# EAGLE design Brians test board 10 (EAGLE 6.5.0)
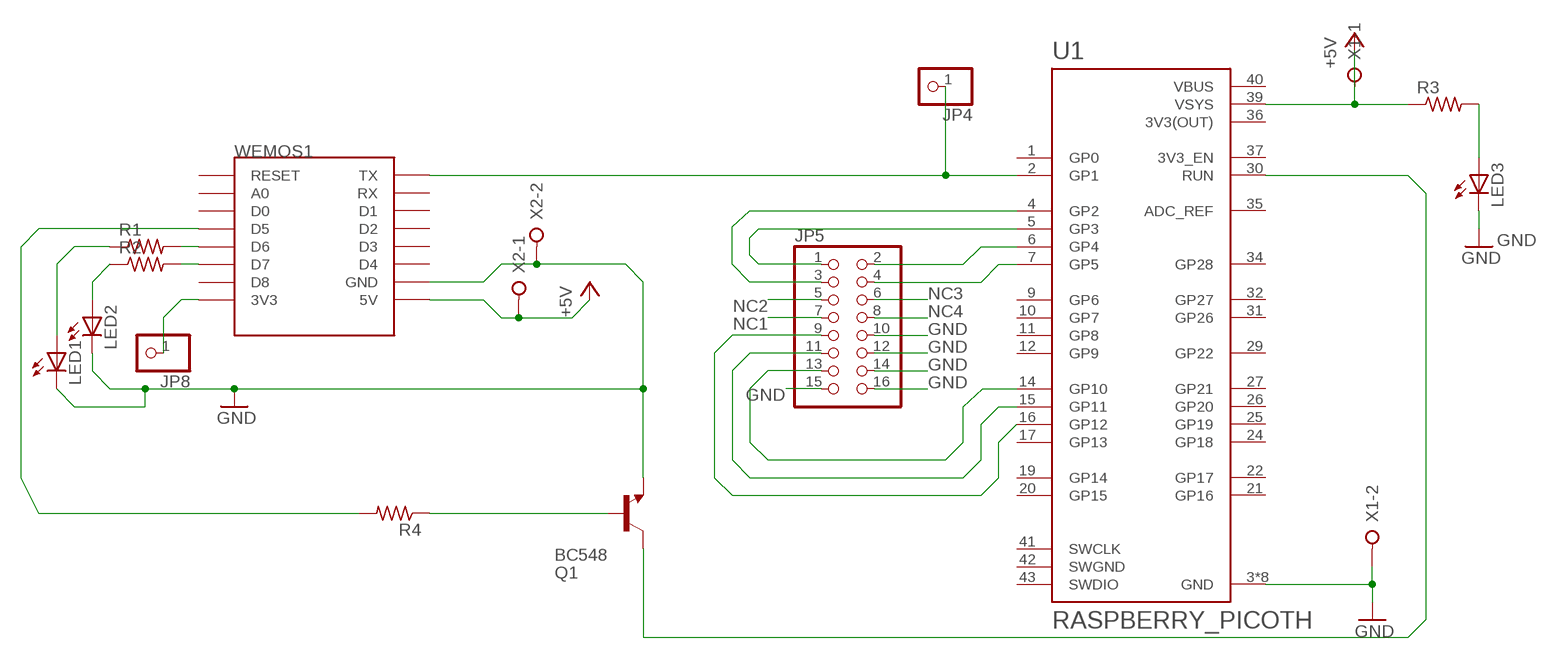
[diagram p0: schematic, sheet 1]

## Parts
JP4  PINHD-1X1  [1X01]
JP5  PINHD-2X8  [2X08]
JP8  PINHD-1X1  [1X01]
LED1  LED3MM  [LED3MM]
LED2  LED3MM  [LED3MM]
LED3  LED3MM  [LED3MM]
Q1  BC548  [TO92-EBC]
R1  R-US_0204/2V  [0204V]
R2  R-US_0204/2V  [0204V]
R3  R-US_0204/5  [0204/5]
R4  R-US_0204/2V  [0204V]
U1  RASPBERRY_PICOTH  [PICO-PKG-TH]
WEMOS1  WEMOS-D1-MINI  [WEMOS-D1-MINI]
X1  W237-02P  [W237-132]
X2  W237-02P  [W237-132]

## Nets
+5V: R3.1 U1.39(VSYS) WEMOS1.5V X1.1 X2.1
GND: JP5.10 JP5.12 JP5.14 JP5.15 JP5.16 LED1.K(C) LED2.K(C) LED3.K(C) Q1.E U1.3(GND) U1.8(GND) U1.13(GND) U1.18(GND) U1.23(GND) U1.28(GND) U1.33(GND) U1.38(GND) WEMOS1.GND X1.2 X2.2
N$3: JP5.1 U1.5(GP3)
N$4: JP8.1 WEMOS1.3V3
N$6: Q1.C U1.30(RUN)
N$7: JP4.1 U1.2(GP1) WEMOS1.TX
N$8: JP5.3 U1.4(GP2)
N$9: R2.2 WEMOS1.D7
N$10: JP5.13 U1.14(GP10)
N$11: JP5.11 U1.15(GP11)
N$12: JP5.9 U1.16(GP12)
N$13: JP5.2 U1.6(GP4)
N$14: JP5.4 U1.7(GP5)
N$15: R1.2 WEMOS1.D6
N$17: LED2.A R2.1
N$18: LED1.A R1.1
N$19: LED3.A R3.2
N$47: R4.2 WEMOS1.D5
N$48: Q1.B R4.1
NC1: JP5.7
NC2: JP5.5
NC3: JP5.6
NC4: JP5.8
Unconnected: U1.1(GP0) U1.9(GP6) U1.10(GP7) U1.11(GP8) U1.12(GP9) U1.17(GP13) U1.19(GP14) U1.20(GP15) U1.21(GP16) U1.22(GP17) U1.24(GP18) U1.25(GP19) U1.26(GP20) U1.27(GP21) U1.29(GP22) U1.31(GP26) U1.32(GP27) U1.34(GP28) U1.35(ADC_REF) U1.37(3V3_EN) U1.41(SWCLK) U1.43(SWDIO) WEMOS1.A0 WEMOS1.D0 WEMOS1.D1 WEMOS1.D2 WEMOS1.D3 WEMOS1.D4 WEMOS1.D8 WEMOS1.RESET WEMOS1.RX

## Power pins joined to a net without a drawn wire
3V3(OUT): U1.36(3V3(OUT))
SWGND: U1.42(SWGND)
VBUS: U1.40(VBUS)

## Library data of the parts
JP4 JP8 = pinhead:PINHD-1X1: PIN HEADER
JP5 = pinhead:PINHD-2X8: PIN HEADER
LED1-LED3 = led:LED: LED OSRAM: - CHIPLED LG R971, LG N971, LY N971, LG Q971, LY Q971, LO R971, LY R971 LH N974, LH R974 LS Q976, LO Q976, LY Q976 LO Q996 - Hyper CHIPLED LW Q18S LB Q993, LB Q99A, LB R99A - SideLED LS A670, LO A670, LY A670, LG A670, LP A670 LB A673, LV A673, LT A673, LW A673 LH A674 LY A675 LS A676, LA A676, LO A676, LY A676, LW A676 LS A679, LY A679, LG A679 - Hyper Micro SIDELED® LS Y876, LA Y876, LO Y876, LY Y876 LT Y87S - SmartLED LW L88C, LW L88S LB L89C, LB L89S, LG L890 LS L89K, LO L89K, LY L89K LS L896, LA L896, LO L896, LY L896 - TOPLED LS T670, LO T670, LY T670, LG T670, LP T670 LSG T670, LSP T670, LSY T670, LOP T670, LYG T670 LG T671, LOG T671, LSG T671 LB T673, LV T673, LT T673, LW T673 LH T674 LS T676, LA T676, LO T676, LY T676, LB T676, LH T676, LSB T676, LW T676 LB T67C, LV T67C, LT T67C, LS T67K, LO T67K, LY T67K, LW E67C LS E67B, LA E67B, LO E67B, LY E67B, LB E67C, LV E67C, LT E67C LW T67C LS T679, LY T679, LG T679 LS T770, LO T770, LY T770, LG T770, LP T770 LB T773, LV T773, LT T773, LW T773 LH T774 LS E675, LA E675, LY E675, LS T675 LS T776, LA T776, LO T776, LY T776, LB T776 LHGB T686 LT T68C, LB T68C - Hyper Mini TOPLED® LB M676 - Mini TOPLED Santana® LG M470 LS M47K, LO M47K, LY M47K Source: http://www.osram.convergy.de LUXEON: - LUMILED® LXK2-PW12-R00, LXK2-PW12-S00, LXK2-PW14-U00, LXK2-PW14-V00 LXK2-PM12-R00, LXK2-PM12-S00, LXK2-PM14-U00 LXK2-PE12-Q00, LXK2-PE12-R00, LXK2-PE12-S00, LXK2-PE14-T00, LXK2-PE14-U00 LXK2-PB12-K00, LXK2-PB12-L00, LXK2-PB12-M00, LXK2-PB14-N00, LXK2-PB14-P00, LXK2-PB14-Q00 LXK2-PR12-L00, LXK2-PR12-M00, LXK2-PR14-Q00, LXK2-PR14-R00 LXK2-PD12-Q00, LXK2-PD12-R00, LXK2-PD12-S00 LXK2-PH12-R00, LXK2-PH12-S00 LXK2-PL12-P00, LXK2-PL12-Q00, LXK2-PL12-R00 Source: www.luxeon.com KINGBRIGHT: KA-3528ASYC Source: www.kingbright.com
Q1 = transistor-npn:BC548*: NPN Transistor
R1-R4 = rcl:R-US_: RESISTOR, American symbol
U1 = RpiPico:RASPBERRY_PICO: Raspberry Pi Pico
WEMOS1 = esp8266modules:WEMOS-D1-MINI: WeMos.cc D1 mini ESP8266 module
X1 X2 = con-wago-508:W237-02P: WAGO SREW CLAMP; OC_FARNELL: unknown; OC_NEWARK: unknown

## Board
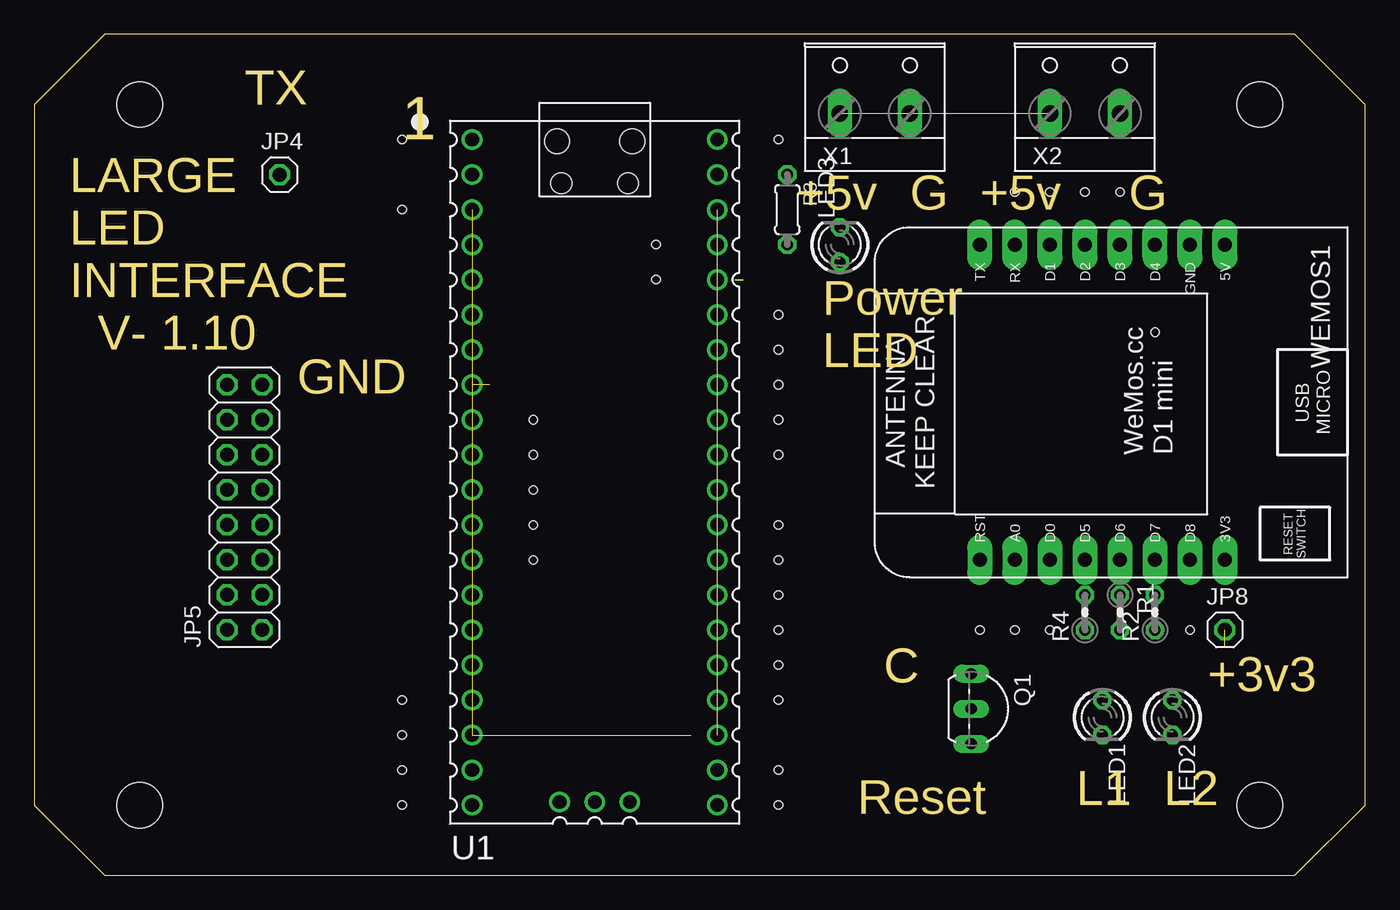
[diagram p1: board, top side]
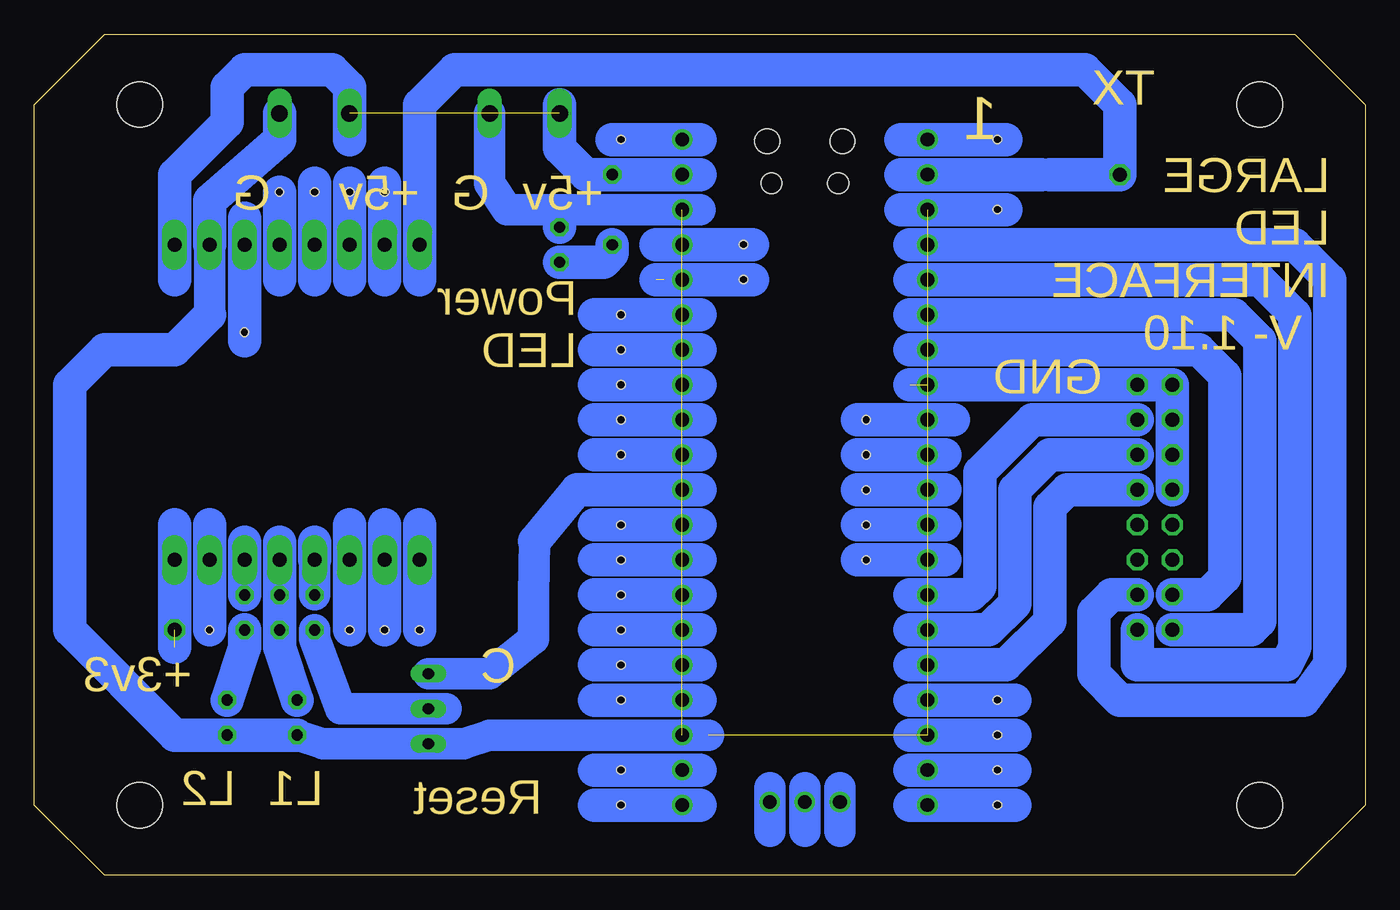
[diagram p2: board, bottom side, seen from below]

Size 96.52 x 60.96 mm. Coordinates in mm from the lower left corner, seen from the top.
Outline: 0,5.08 5.08,0 91.44,0 96.52,5.08 96.52,55.88 91.44,60.96 5.08,60.96 0,55.88 0,5.08
Copper layers (1*16): Top 0.035mm / dielectric 1.5mm / Bottom 0.035mm
Design rules "default": minimum track width 10mil, minimum drill 24mil, track to track 8mil, track to pad 8mil, pad to pad 8mil, via to via 8mil, smd to smd 8mil, copper to edge 40mil, drill to drill 8mil, minimum pad ring 10mil, minimum via ring 8mil, stop-mask expansion 4mil, vias tented up to drill 0mil, thermal gap 10mil
Holes 3.3 mm at 7.62,55.88 88.9,55.88 7.62,5.08 88.9,5.08
Holes 0.6 mm at 26.67,53.34 26.67,48.26 36.2,33.02 36.2,30.48 36.2,27.94 36.2,25.4 36.2,22.86 26.67,12.7 26.67,10.16 26.67,7.62 26.67,5.08 53.98,53.34 53.98,40.64 53.98,38.1 53.98,35.56 53.98,33.02 53.98,30.48 53.98,22.86 53.98,20.32 53.98,17.78 53.98,15.24 53.98,12.7 53.98,7.62 53.98,5.08 45.09,45.72 45.09,43.18 53.98,25.4 71.12,49.53 73.66,49.53 76.2,49.53 78.74,49.53 81.28,39.37 83.82,17.78 73.66,17.78 71.12,17.78 68.58,17.78

### Footprints (pad centres in the part's own frame; a part is rotated, then mirrored left to right if it is on the bottom)
1X01 = drill 1.016 octagon: 1 0,0
2X08 = drill 1.016 octagon: 1 -8.89,-1.27; 2 -8.89,1.27; 3 -6.35,-1.27; 4 -6.35,1.27; 5 -3.81,-1.27; 6 -3.81,1.27; 7 -1.27,-1.27; 8 -1.27,1.27; 9 1.27,-1.27; 10 1.27,1.27; 11 3.81,-1.27; 12 3.81,1.27; 13 6.35,-1.27; 14 6.35,1.27; 15 8.89,-1.27; 16 8.89,1.27
LED3MM = drill 0.813 octagon: A -1.27,0; K 1.27,0
TO92-EBC = drill 0.813 long: B 0,-1.27; C -2.54,-1.27; E 2.54,-1.27
0204V = drill 0.813 octagon: 1 -1.27,0; 2 1.27,0
0204/5 = drill 0.813 octagon: 1 -2.54,0; 2 2.54,0
PICO-PKG-TH = drill 1: 1 -8.89,24.13; 2 -8.89,21.59; 3 -8.89,19.05; 4 -8.89,16.51; 5 -8.89,13.97; 6 -8.89,11.43; 7 -8.89,8.89; 8 -8.89,6.35; 9 -8.89,3.81; 10 -8.89,1.27; 11 -8.89,-1.27; 12 -8.89,-3.81; 13 -8.89,-6.35; 14 -8.89,-8.89; 15 -8.89,-11.43; 16 -8.89,-13.97; 17 -8.89,-16.51; 18 -8.89,-19.05; 19 -8.89,-21.59; 20 -8.89,-24.13; 21 8.89,-24.13; 22 8.89,-21.59; 23 8.89,-19.05; 24 8.89,-16.51; 25 8.89,-13.97; 26 8.89,-11.43; 27 8.89,-8.89; 28 8.89,-6.35; 29 8.89,-3.81; 30 8.89,-1.27; 31 8.89,1.27; 32 8.89,3.81; 33 8.89,6.35; 34 8.89,8.89; 35 8.89,11.43; 36 8.89,13.97; 37 8.89,16.51; 38 8.89,19.05; 39 8.89,21.59; 40 8.89,24.13; 41 -2.54,-23.9; 42 0,-23.9; 43 2.54,-23.9 | hole 1.8: -2.725,24; 2.725,24 | hole 1.5: -2.425,20.97; 2.425,20.97
WEMOS-D1-MINI = drill 1.016 pad 1.829 long: 3V3 -10.16,-10.16; 5V 12.7,-10.16; A0 -10.16,5.08; D0 -10.16,2.54; D1 12.7,2.54; D2 12.7,0; D3 12.7,-2.54; D4 12.7,-5.08; D5 -10.16,0; D6 -10.16,-2.54; D7 -10.16,-5.08; D8 -10.16,-7.62; GND 12.7,-7.62; RESET -10.16,7.62; RX 12.7,5.08; TX 12.7,7.62
W237-132 = drill 1.194 long: 1 -2.54,-0.635; 2 2.54,-0.635

### Placement (x,y rotation side)
JP4  17.78,50.8 0 top
JP5  15.24,26.67 90 top
JP8  86.36,17.78 0 top
LED1  77.47,11.43 270 top
LED2  82.55,11.43 270 top
LED3  58.42,45.72 90 top
Q1  69.22,12.06 270 top
R1  78.74,19.05 270 top
R2  81.28,19.05 90 top
R3  54.61,48.26 270 top
R4  76.2,19.05 90 top
U1  40.64,29.21 0 top
WEMOS1  76.2,33.02 90 top
X1  60.96,55.88 0 top
X2  76.2,55.88 0 top

### Tracks (layer width: path | path; a pad name or v marks a point on that pad's centre or on a via)
+5V  (1 unrouted)
  Bottom 2.413: 48.26,50.8 U1.39 R3.1 56.52,50.8 58.42,52.7 58.42,53.34 X1.1 58.42,55.88 | 73.66,53.34 X2.1 73.66,57.15 74.93,58.42 81.28,58.42 82.55,57.15 82.55,54.61 86.36,50.8 WEMOS1.5V 86.36,43.18
GND  (8 unrouted)
  Bottom 1.016: U1.23 50.8,10.16 | 58.42,48.26 58.42,47.62
  Bottom 2.286: WEMOS1.GND 83.82,40.64 | X1.2 63.5,50.16 62.23,48.26 58.42,48.26 U1.38 48.26,48.26 | LED1.K 75.56,9.53 Q1.E 65.41,9.53 63.5,10.16 U1.23 47.62,10.16
  Bottom 2.413: LED3.K 58.42,47.62 | JP5.10 JP5.12 JP5.14 JP5.16 JP5.15 33.02,35.56 | LED1.K LED2.K 86.36,10.16 93.98,17.78 93.98,35.56 91.44,38.1 86.36,38.1 83.82,40.64 | X2.2 78.74,53.34 83.82,48.9 WEMOS1.GND
N$2
  Bottom 2.286: 60.96,10.16 59.69,10.16
N$3
  Bottom 2.413: 33.02,43.18 U1.5 7.62,43.18 5.08,40.64 5.08,16.51 5.71,15.24 16.51,15.24 JP5.1
N$4  (1 unrouted)
  Bottom 2.413: 86.36,25.4 WEMOS1.3V3 86.36,16.51
N$6
  Bottom 2.286: Q1.C 63.5,14.61 60.33,17.14 60.33,20.32 60.25,24.21
  Bottom 2.413: 48.26,27.94 U1.30 57.15,27.94 60.25,24.21
N$7
  Bottom 1.016: U1.2 22.86,50.8
  Bottom 2.413: 22.86,50.8 JP4.1 17.78,55.88 20.32,58.42 66.04,58.42 68.58,55.88 WEMOS1.TX 68.58,43.18
N$8
  Bottom 2.413: 33.02,45.72 U1.4 5.08,45.72 2.54,43.18 2.54,15.24 4.45,12.7 17.78,12.7 19.68,14.61 19.68,19.05 18.41,20.32 JP5.3
N$9
  Bottom 2.413: 81.28,24.13 WEMOS1.D7 R2.2
N$10
  Bottom 2.413: JP5.13 24.13,33.02 27.94,29.21 27.94,20.95 28.57,20.32 U1.14 33.02,20.32
N$11
  Bottom 2.413: 33.02,17.78 U1.15 27.3,17.78 25.4,19.68 25.4,27.94 22.86,30.48 JP5.11
N$12
  Bottom 2.413: JP5.9 21.59,27.94 22.86,26.67 22.86,18.41 26.04,15.24 U1.16 33.02,15.24
N$13
  Bottom 2.413: JP5.2 8.26,17.78 7.62,18.41 7.62,38.73 9.53,40.64 U1.6 33.02,40.64
N$14
  Bottom 2.413: JP5.4 11.43,20.32 10.16,21.59 10.16,36.2 12.06,38.1 U1.7 33.02,38.1
N$15
  Bottom 2.413: 78.74,24.13 WEMOS1.D6 R1.2
N$17
  Bottom 2.413: R2.1 81.28,16.51 LED2.A
N$18
  Bottom 2.413: R1.1 78.74,16.51 LED1.A
N$19
  Bottom 2.413: LED3.A 55.24,44.45 54.61,45.09 R3.2
N$20
  Bottom 2.413: 33.02,12.7 32.38,12.7 25.4,12.7
N$21
  Bottom 2.413: 25.4,10.16 33.02,10.16
N$22
  Bottom 2.413: 25.4,7.62 33.02,7.62
N$23
  Bottom 2.413: 25.4,5.08 33.02,5.08
N$24
  Bottom 2.413: 48.26,5.08 55.88,5.08
N$25
  Bottom 2.413: 48.26,7.62 55.88,7.62
N$26
  Bottom 2.413: 48.26,12.7 55.88,12.7
N$27
  Bottom 2.413: 48.26,15.24 55.88,15.24
N$28
  Bottom 2.413: 48.26,17.78 55.88,17.78
N$29
  Bottom 2.413: 48.26,20.32 55.88,20.32
N$30
  Bottom 2.413: 48.26,22.86 55.88,22.86
N$31
  Bottom 2.413: 48.26,30.48 55.88,30.48
N$32
  Bottom 2.413: 48.26,33.02 55.88,33.02
N$33
  Bottom 2.286: 38.1,6.35 38.1,3.17
N$34
  Bottom 2.413: 48.26,35.56 55.88,35.56
N$35
  Bottom 2.413: 48.26,38.1 55.88,38.1
N$36
  Bottom 2.413: 48.26,40.64 55.88,40.64
N$37
  Bottom 2.286: 40.64,6.35 40.64,3.17
N$38
  Bottom 2.286: 43.18,6.35 43.18,3.17
N$39
  Bottom 2.413: 48.26,53.34 53.34,53.34 54.61,53.34
N$40
  Bottom 2.413: 33.66,53.34 26.04,53.34
N$41
  Bottom 2.413: 33.66,50.8 23.5,50.8
N$42
  Bottom 2.413: 29.84,33.02 36.83,33.02
N$43
  Bottom 2.413: 30.48,30.48 36.83,30.48
N$44
  Bottom 2.413: 30.48,27.94 36.83,27.94
N$45
  Bottom 2.413: 30.48,25.4 36.83,25.4
N$46
  Bottom 2.413: 30.48,22.86 36.83,22.86
N$47
  Bottom 0.09: 76.83,22.23 WEMOS1.D5
  Bottom 2.286: R4.2 WEMOS1.D5
  Bottom 2.413: WEMOS1.D5 76.2,24.13
N$48
  Bottom 2.286: R4.1 76.2,17.14 74.3,12.06 Q1.B 66.67,12.06
N$53
  Bottom 2.413: 83.82,25.4 83.82,17.78
N$54
  Bottom 2.413: 73.66,25.4 73.66,17.78
N$55
  Bottom 2.413: 71.12,25.4 71.12,17.78
N$56
  Bottom 2.413: 68.58,25.4 68.58,17.78
N$57
  Bottom 2.413: 33.66,48.26 33.02,48.26 32.38,48.26 26.04,48.26
N$58
  Bottom 2.413: 51.44,45.72 44.45,45.72
N$59  (1 unrouted)
  Bottom 2.413: 51.44,43.18 48.26,43.18 | 50.8,43.18 44.45,43.18
N$60
  Bottom 2.413: 48.26,25.4 55.88,25.4
N$61
  Bottom 2.413: 71.12,43.18 71.12,50.16
N$62
  Bottom 2.413: 73.66,43.18 73.66,50.16
N$63
  Bottom 2.413: 76.2,43.18 76.2,50.16
N$64
  Bottom 2.413: 78.74,43.18 78.74,49.53
N$65
  Bottom 2.413: 81.28,47.62 81.28,38.73

### Text on the board
Milling: TX | 1 | +5v | G | +5v | G | LARGE / LED / INTERFACE / V- 1.10 | Power / LED | GND | C | +3v3 | L1 | L2 | Reset